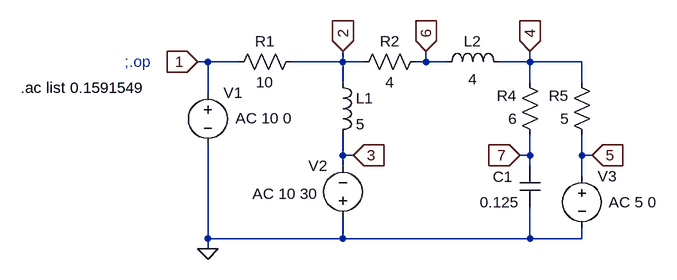
[diagram p0: schematic Phasor-analysis1.asc]
Phasor-analysis1.asc, the LTspice schematic file:
Version 4
SHEET 1 880 680
WIRE -64 48 -80 48
WIRE -16 48 -64 48
WIRE 144 48 144 32
WIRE 144 48 64 48
WIRE 176 48 144 48
WIRE 272 48 272 32
WIRE 272 48 256 48
WIRE 304 48 272 48
WIRE 432 48 432 32
WIRE 432 48 384 48
WIRE 512 48 432 48
WIRE 144 80 144 48
WIRE 432 80 432 48
WIRE 512 80 512 48
WIRE -64 96 -64 48
WIRE 144 192 144 160
WIRE 160 192 144 192
WIRE 432 192 432 160
WIRE 432 192 416 192
WIRE 512 192 512 160
WIRE 528 192 512 192
WIRE 144 208 144 192
WIRE 432 208 432 192
WIRE 512 224 512 192
WIRE -64 320 -64 176
WIRE 144 320 144 288
WIRE 144 320 -64 320
WIRE 432 320 432 272
WIRE 432 320 144 320
WIRE 512 320 512 304
WIRE 512 320 432 320
WIRE -64 336 -64 320
FLAG -80 48 1
IOPIN -80 48 In
FLAG 144 32 2
IOPIN 144 32 In
FLAG 160 192 3
IOPIN 160 192 In
FLAG 432 32 4
IOPIN 432 32 In
FLAG 528 192 5
IOPIN 528 192 In
FLAG -64 336 0
FLAG 416 192 7
IOPIN 416 192 In
FLAG 272 32 6
IOPIN 272 32 In
SYMBOL voltage -64 80 R0
WINDOW 123 43 55 Left 2
WINDOW 39 0 0 Left 0
SYMATTR Value2 AC 10 0
SYMATTR InstName V1
SYMATTR Value ""
SYMBOL voltage 144 304 R180
WINDOW 0 24 96 Left 2
WINDOW 3 24 16 Left 2
WINDOW 123 39 53 Left 2
WINDOW 39 0 0 Left 0
SYMATTR InstName V2
SYMATTR Value ""
SYMATTR Value2 AC 10 30
SYMBOL voltage 512 208 R0
WINDOW 123 41 56 Left 2
WINDOW 39 0 0 Left 0
SYMATTR Value2 AC 5 0
SYMATTR InstName V3
SYMATTR Value ""
SYMBOL res 80 32 R90
WINDOW 0 0 56 VBottom 2
WINDOW 3 32 56 VTop 2
SYMATTR InstName R1
SYMATTR Value 10
SYMBOL res 272 32 R90
WINDOW 0 0 56 VBottom 2
WINDOW 3 32 56 VTop 2
SYMATTR InstName R2
SYMATTR Value 4
SYMBOL res 448 176 R180
WINDOW 0 36 76 Left 2
WINDOW 3 36 40 Left 2
SYMATTR InstName R4
SYMATTR Value 6
SYMBOL res 528 176 R180
WINDOW 0 36 76 Left 2
WINDOW 3 36 40 Left 2
SYMATTR InstName R5
SYMATTR Value 5
SYMBOL ind 128 64 R0
SYMATTR InstName L1
SYMATTR Value 5
SYMATTR SpiceLine Rser=0
SYMBOL ind 288 64 R270
WINDOW 0 32 56 VTop 2
WINDOW 3 5 56 VBottom 2
SYMATTR InstName L2
SYMATTR Value 4
SYMATTR SpiceLine Rser=0
SYMBOL cap 416 208 R0
WINDOW 0 -41 17 Left 2
WINDOW 3 -61 56 Left 2
SYMATTR InstName C1
SYMATTR Value 0.125
TEXT -192 48 Left 2 ;;.op
TEXT -352 88 Left 2 !.ac list 0.1591549

The netlist it stands for:
* Phasor-analysis1.asc
V1 1 0 AC 10 0
V2 0 3 AC 10 30
V3 5 0 AC 5 0
R1 2 1 10
R2 6 2 4
R4 7 4 6
R5 5 4 5
L1 2 3 5 Rser=0
L2 6 4 4 Rser=0
C1 7 0 0.125
* ;.op
.ac list 0.1591549
.backanno
.end